# Altium schematic sheet Sheet1.SchDoc
size A
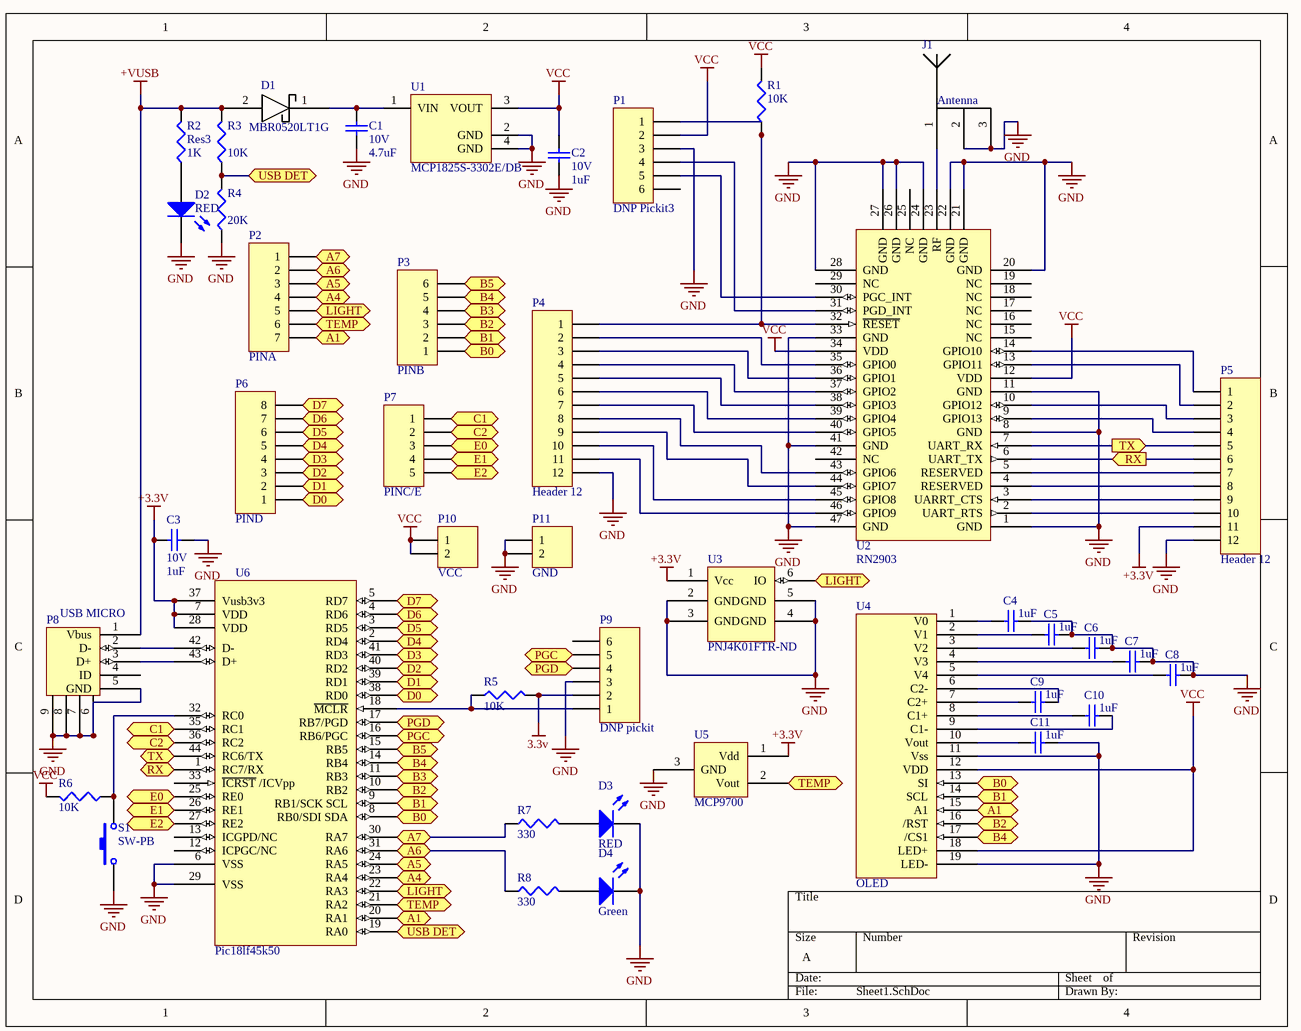
[diagram p0: Sheet1.SchDoc]

## Parts
C1  10V  value 4.7uF  [1608[0603]]
C2  10V  value 1uF  [1608[0603]]
C3  10V  value 1uF  [1608[0603]]
C4  value 1uF  [1608[0603]]  (hidden comment: 10V)
C5  value 1uF  [1608[0603]]  (hidden comment: 10V)
C6  value 1uF  [1608[0603]]  (hidden comment: 10V)
C7  value 1uF  [1608[0603]]  (hidden comment: 10V)
C8  value 1uF  [1608[0603]]  (hidden comment: 10V)
C9  value 1uF  [1608[0603]]  (hidden comment: 10V)
C10  value 1uF  [1608[0603]]  (hidden comment: 10V)
C11  value 1uF  [1608[0603]]  (hidden comment: 10V)
D1  MBR0520LT1G  [Diode]
D2  RED  [LED]
D3  RED  [LED]
D4  Green  [LED]
J1  Antenna  [Antenna]
P1  DNP Pickit3  [HDR1X6]
P2  PINA  [HDR1X7]
P3  PINB  [HDR1X6]
P4  Header 12  [HDR1X12]
P5  Header 12  [HDR1X12]
P6  PIND  [HDR1X8]
P7  PINC/E  [HDR1X5]
P8  USB MICRO  [CONN USB MICRO B]
P9  DNP pickit  [HDR1X6]
P10  VCC  [HDR1X2]
P11  GND  [HDR1X2]
R1  value 10K  [Resistor]  (hidden comment: Res3)
R2  Res3  value 1K  [Resistor]
R3  value 10K  [Resistor]  (hidden comment: Res3)
R4  value 20K  [Resistor]  (hidden comment: Res3)
R5  value 10K  [Resistor]  (hidden comment: Res3)
R6  value 10K  [Resistor]  (hidden comment: Res3)
R7  value 330  [Resistor]  (hidden comment: Res3)
R8  value 330  [Resistor]  (hidden comment: Res3)
S1  SW-PB  [SPST-2]
U1  MCP1825S-3302E/DB  [SOT-223-DB3_L]
U2  RN2903  [RN2903]
U3  PNJ4K01FTR-ND  [PNJ4K01FTR-ND]
U4  OLED  [OLED]
U5  MCP9700  [SOT95P237X10-3N]
U6  Pic18lf45k50  [TQFP80P1200X1200X120-44N]

## Ports
A1 (bidir), A4 (bidir), A5 (bidir), A6 (bidir), A7 (bidir), B0 (bidir), B1 (bidir), B2 (bidir), B3 (bidir), B4 (bidir), B5 (bidir), C1 (bidir), C2 (bidir), D0 (bidir), D1 (bidir), D2 (bidir), D3 (bidir), D4 (bidir), D5 (bidir), D6 (bidir), D7 (bidir), E0 (bidir), E1 (bidir), E2 (bidir), LIGHT (in), PGC (bidir), PGC (in), PGD (bidir), RX (in), TEMP (in), TX (out), USB DET

## Nets
3.3v: P9.2 R5.2
+3.3V: C3.2 P5.11 U3.1(Vcc) U5.1(Vdd) U6.7(VDD) U6.28(VDD) U6.37(Vusb3v3)
+VUSB: D1.2 P8.1(Vbus) R2.2 R3.2
GND: C1.1 C2.1 C3.1 C4.1 C5.1 C6.1 C7.1 C8.1 C11.1 D2.2(K) D3.2(K) D4.2(K) J1.2 J1.3 P1.3 P4.12 P5.12 P8.5(GND) P8.6(GND) P8.7(GND) P8.8(GND) P8.9(GND) P9.3 P11.1 P11.2 R4.1 S1.1 U1.2(GND) U1.4(GND) U2.1(GND) U2.8(GND) U2.11(GND) U2.20(GND) U2.21(GND) U2.22(GND) U2.24(GND) U2.26(GND) U2.27(GND) U2.28(GND) U2.33(GND) U2.41(GND) U2.47(GND) U3.2(GND) U3.3(GND) U3.4(GND) U3.5(GND) U4.11(Vss) U4.19(LED-) U5.3(GND) U6.6(VSS) U6.29(VSS)
VCC: C2.2 P1.2 P10.1 P10.2 R1.2 R6.2 U1.3(VOUT) U2.12(VDD) U2.34(VDD) U4.12(VDD) U4.18(LED+)
A1: P2.7 U4.15(A1) U6.20(RA1) ; port A1
A4: P2.4 U6.23(RA4) ; port A4
A5: P2.3 U6.24(RA5) ; port A5
A6: P2.2 R8.1 U6.31(RA6) ; port A6
A7: P2.1 R7.1 U6.30(RA7) ; port A7
B0: P3.1 U4.13(SI) U6.8(RB0/SDI_SDA) ; port B0
B1: P3.2 U4.14(SCL) U6.9(RB1/SCK_SCL) ; port B1
B2: P3.3 U4.16(/RST) U6.10(RB2) ; port B2
B3: P3.4 U6.11(RB3) ; port B3
B4: P3.5 U4.17(/CS1) U6.14(RB4) ; port B4
B5: P3.6 U6.15(RB5) ; port B5
C1: P7.1 U6.35(RC1) ; port C1
C2: P7.2 U6.36(RC2) ; port C2
D0: P6.1 U6.38(RD0) ; port D0
D1: P6.2 U6.39(RD1) ; port D1
D2: P6.3 U6.40(RD2) ; port D2
D3: P6.4 U6.41(RD3) ; port D3
D4: P6.5 U6.2(RD4) ; port D4
D5: P6.6 U6.3(RD5) ; port D5
D6: P6.7 U6.4(RD6) ; port D6
D7: P6.8 U6.5(RD7) ; port D7
E0: P7.3 U6.25(RE0) ; port E0
E1: P7.4 U6.26(RE1) ; port E1
E2: P7.5 U6.27(RE2) ; port E2
LIGHT: P2.5 U3.6(IO) U6.22(RA3) ; port LIGHT
PGC: P9.5 U6.16(RB6/PGC) ; port PGC
PGD: P9.4 U6.17(RB7/PGD) ; port PGD
RX: P5.6 U2.6(UART_TX) U6.1(RC7/RX) ; port RX
TEMP: P2.6 U5.2(Vout) U6.21(RA2) ; port TEMP
TX: P5.5 U2.7(UART_RX) U6.44(RC6/TX) ; port TX
USB DET: R3.1 R4.2 U6.19(RA0) ; port USB DET
NetC1_2: C1.2 D1.1 U1.1(VIN)
NetC4_2: C4.2 U4.1(V0)
NetC5_2: C5.2 U4.2(V1)
NetC6_2: C6.2 U4.3(V2)
NetC7_2: C7.2 U4.4(V3)
NetC8_2: C8.2 U4.5(V4)
NetC9_1: C9.1 U4.6(C2-)
NetC9_2: C9.2 U4.7(C2+)
NetC10_1: C10.1 U4.9(C1-)
NetC10_2: C10.2 U4.8(C1+)
NetC11_2: C11.2 U4.10(Vout)
NetD2_1: D2.1(A) R2.1
NetD3_1: D3.1(A) R7.2
NetD4_1: D4.1(A) R8.2
NetJ1_1: J1.1 U2.23(RF)
NetP1_1: P1.1 P4.1 R1.1 U2.32(~{RESET})
NetP1_4: P1.4 U2.31(PGD_INT)
NetP1_5: P1.5 U2.30(PGC_INT)
NetP4_2: P4.2 U2.35(GPIO0)
NetP4_3: P4.3 U2.36(GPIO1)
NetP4_4: P4.4 U2.37(GPIO2)
NetP4_5: P4.5 U2.38(GPIO3)
NetP4_6: P4.6 U2.39(GPIO4)
NetP4_7: P4.7 U2.40(GPIO5)
NetP4_8: P4.8 U2.43(GPIO6)
NetP4_9: P4.9 U2.44(GPIO7)
NetP4_10: P4.10 U2.45(GPIO8)
NetP4_11: P4.11 U2.46(GPIO9)
NetP5_1: P5.1 U2.14(GPIO10)
NetP5_2: P5.2 U2.13(GPIO11)
NetP5_3: P5.3 U2.10(GPIO12)
NetP5_4: P5.4 U2.9(GPIO13)
NetP5_7: P5.7 U2.5(RESERVED)
NetP5_8: P5.8 U2.4(RESERVED)
NetP5_9: P5.9 U2.3(UARRT_CTS)
NetP5_10: P5.10 U2.2(UART_RTS)
NetP8_2: P8.2(D-) U6.42(D-)
NetP8_3: P8.3(D+) U6.43(D+)
NetP9_1: P9.1 R5.1 U6.18(~{MCLR})
NetR6_1: R6.1 S1.2 U6.32(RC0)

Not connected (* = marked no-connect by the designer): P1 6; P8 4(ID); P9 6; U2 15(NC) 16(NC) 17(NC) 18(NC) 19(NC) 25(NC) 29(NC) 42(NC); U6 12(ICPGC/NC) 13(ICGPD/NC) 33(~{ICRST}_/ICVpp)

## Library data of the parts
C1-C11 = Cap Semi: Capacitor (Semiconductor SIM Model); Published: 8-Jun-2000; LatestRevisionDate: 17-Jul-2002; LatestRevisionNote: Re-released for DXP Platform.; PackageReference: C1206; Publisher: Altium Limited
D1 = MBR0520LT1GOSTR-ND
D2-D4 = LED2: Typical RED, GREEN, YELLOW, AMBER GaAs LED; Published: 8-Jun-2000; LatestRevisionDate: 17-Jul-2002; LatestRevisionNote: Re-released for DXP Platform.; PackageDocument: Feb-2002; PackageReference: 3.2X1.6X1.1; Publisher: Altium Limited
P1 P3 P9 = Header 6: Header, 6-Pin; LatestRevisionDate: 17-Jul-2002; LatestRevisionNote: Re-released for DXP Platform.; Publisher: Altium Limited
P2 = Header 7: Header, 7-Pin; LatestRevisionDate: 17-Jul-2002; LatestRevisionNote: Re-released for DXP Platform.; Publisher: Altium Limited
P4 P5 = Header 12: Header, 12-Pin; LatestRevisionDate: 17-Jul-2002; LatestRevisionNote: Re-released for DXP Platform.; Publisher: Altium Limited
P6 = Header 8: Header, 8-Pin; LatestRevisionDate: 17-Jul-2002; LatestRevisionNote: Re-released for DXP Platform.; Publisher: Altium Limited
P7 = Header 5: Header, 5-Pin; LatestRevisionDate: 17-Jul-2002; LatestRevisionNote: Re-released for DXP Platform.; Publisher: Altium Limited
P8 = CONN USB MICRO B
P10 P11 = Header 2: Header, 2-Pin; LatestRevisionDate: 17-Jul-2002; LatestRevisionNote: Re-released for DXP Platform.; Publisher: Altium Limited
R1-R8 = Res3: Resistor; Published: 8-Jun-2000; LatestRevisionDate: 04-Mar-2005; LatestRevisionNote: PCB Footprint replaced.; PackageReference: J1-0603; Publisher: Altium Limited
S1 = SW-PB: Switch; Published: 24-Mar-1999; LatestRevisionDate: 17-Jul-2002; LatestRevisionNote: Re-released for DXP Platform.; PackageReference: SPST-2; Publisher: Altium Limited
U1 = MCP1825S-3302E/DB: 500 mA, Low Voltage, Low Quiescent Current LDO Regulator, 3-Pin SOT-223, Extended Temperature; Published: 29-Jan-2009; DatasheetVersion: revB, Feb-2008; PackageVersion: revBB, Aug-2009; PackageReference: SOT-223-DB3; Publisher: Altium Limited; PackageDescription: 3-Lead Plastic Small Outline Transistor (DB) [SOT-223]; Supplier 1: Digi-Key; Supplier Part Number 1: MCP1825S-3302E/DB-ND; Supplier 2: Farnell; Supplier Part Number 2: 1578404; ComponentLink1Description: Datasheet; ComponentLink1URL: http://ww1.microchip.com/downloads/en/DeviceDoc/22056b.pdf; ComponentLink2Description: Packaging Specification; ComponentLink2URL: http://www.microchip.com/stellent/groups/techpub_sg/documents/packagingspec/en012702.pdf; ComponentLink3Description: Microchip.com Home; ComponentLink3URL: http://www.microchip.com/